# EAGLE design backpack_board (EAGLE 7.1.0)
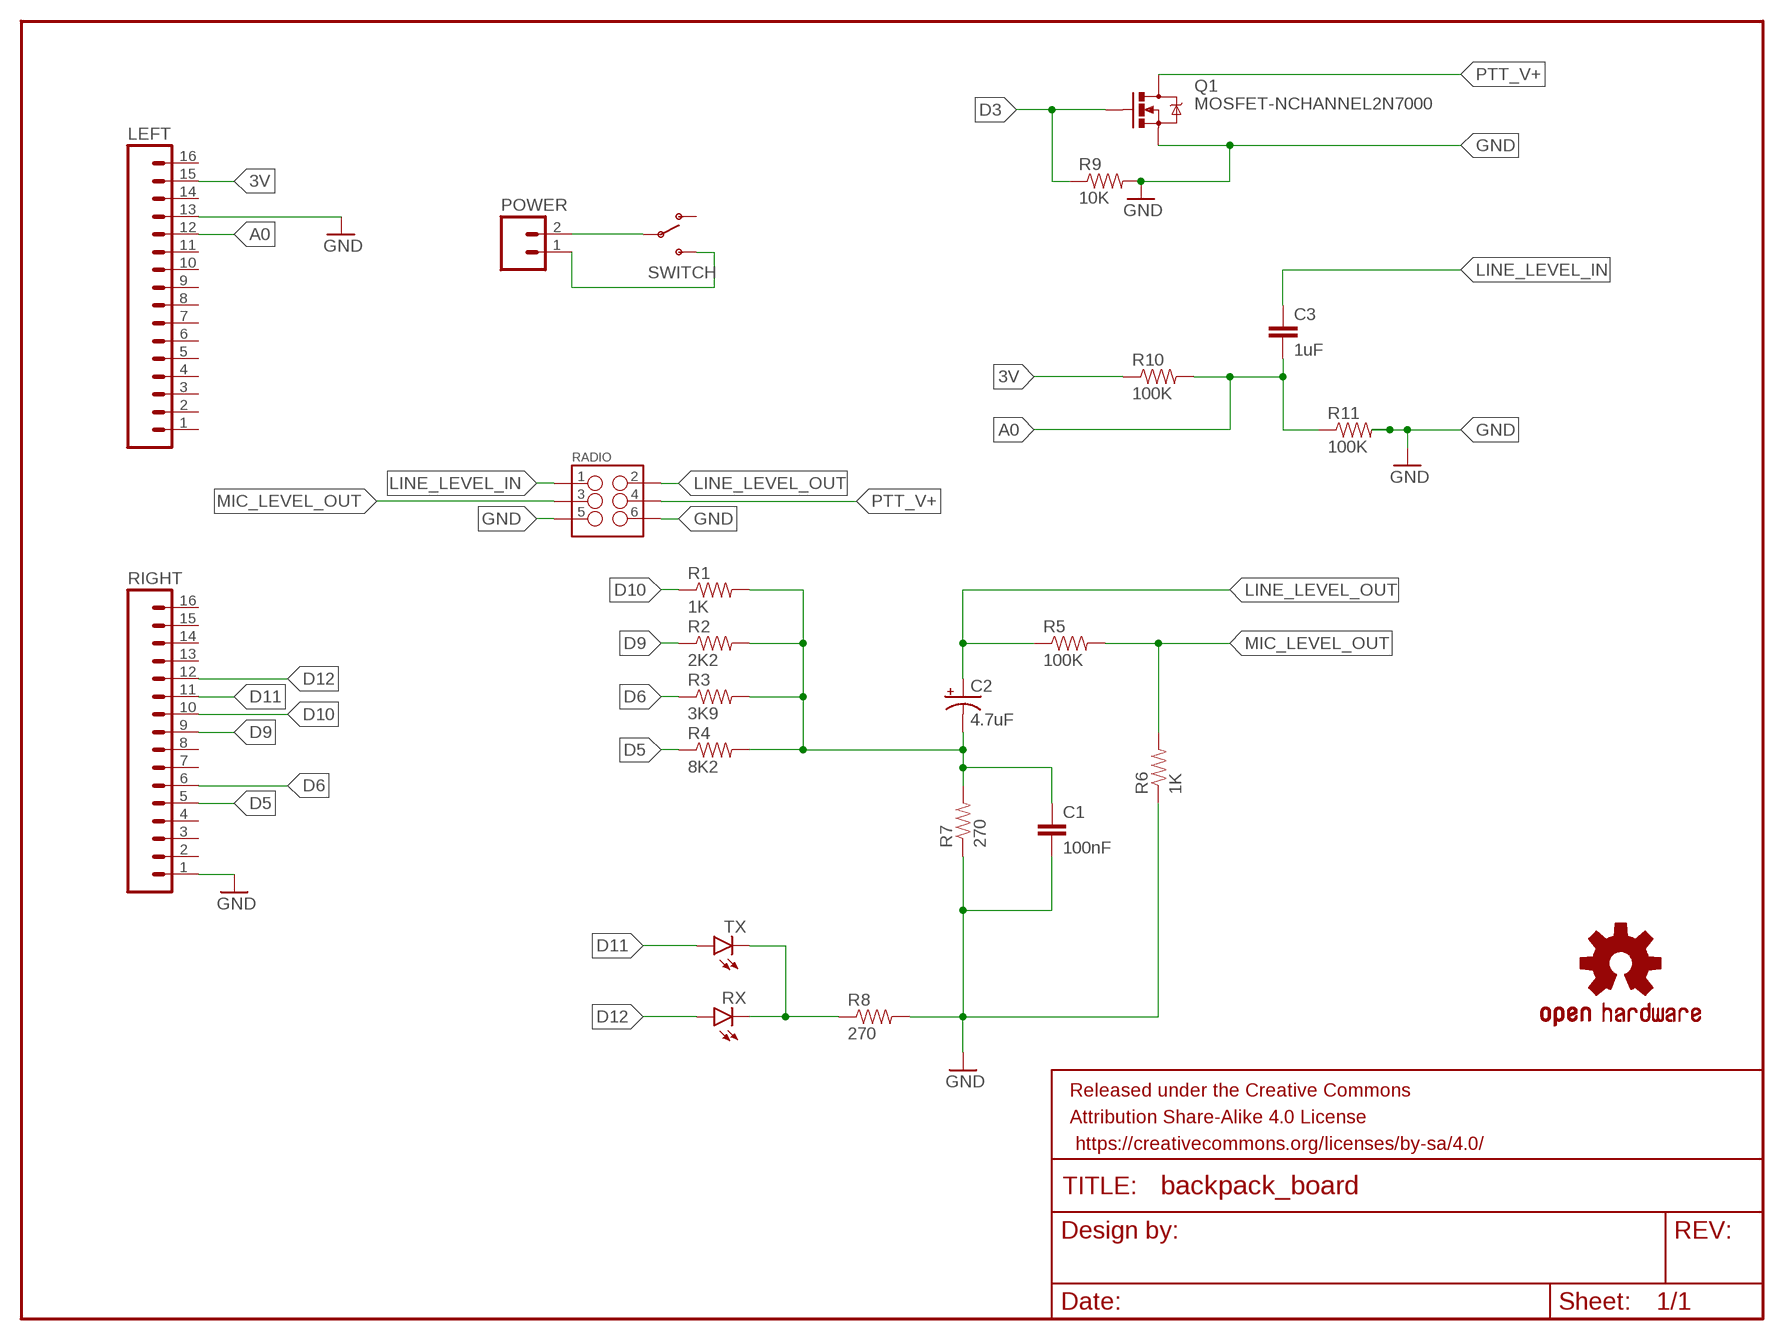
[diagram p0: schematic, sheet 1]

## Parts
C1  100nF  CAPPTH  [CAP-PTH-SMALL]
C2  4.7uF  CAP_POLPTH2  [CPOL-RADIAL-10UF-25V]
C3  1uF  CAPPTH  [CAP-PTH-SMALL]
FRAME1  FRAME-LETTERNO_PACKAGE  [DUMMY]
LEFT  M16PTH  [1X16]
LOGO1  OSHW-LOGOM  [OSHW-LOGO-M]
POWER  M02PTH  [1X02]
Q1  MOSFET-NCHANNEL2N7000  [TO-92]
R1  1K  RESISTORPTH-1/4W  [AXIAL-0.4]
R2  2K2  RESISTORPTH-1/4W  [AXIAL-0.4]
R3  3K9  RESISTORPTH-1/4W  [AXIAL-0.4]
R4  8K2  RESISTORPTH-1/4W  [AXIAL-0.4]
R5  100K  RESISTORPTH-1/4W  [AXIAL-0.4]
R6  1K  RESISTORPTH-1/4W  [AXIAL-0.4]
R7  270  RESISTORPTH-1/4W  [AXIAL-0.4]
R8  270  RESISTORPTH-1/4W  [AXIAL-0.4]
R9  10K  RESISTORPTH-1/4W  [AXIAL-0.4]
R10  100K  RESISTORPTH-1/4W  [AXIAL-0.4]
R11  100K  RESISTORPTH-1/4W  [AXIAL-0.4]
RADIO  M03X2FEMALE  [2X3]
RIGHT  M16PTH  [1X16]
RX  LED3MM  [LED3MM]
SWITCH  SWITCH-SPDTPTH  [SWITCH-SPDT]
TX  LED3MM  [LED3MM]

## Nets
3V: LEFT.15 R10.P$1
A0: C3.2 LEFT.12 R10.P$2 R11.P$1
D3: Q1.2(G) R9.P$1
D5: R4.P$1 RIGHT.5
D6: R3.P$1 RIGHT.6
D9: R2.P$1 RIGHT.9
D10: R1.P$1 RIGHT.10
D11: RIGHT.11 TX.A
D12: RIGHT.12 RX.A
GND: C1.2 LEFT.13 Q1.1(S) R6.P$1 R7.P$1 R8.P$2 R9.P$2 R11.P$2 RADIO.5 RADIO.6 RIGHT.1
LINE_LEVEL_IN: C3.1 RADIO.1
LINE_LEVEL_OUT: C2.1(+) R5.P$1 RADIO.2
MIC_LEVEL_OUT: R5.P$2 R6.P$2 RADIO.3
N$1: C1.1 C2.2(-) R1.P$2 R2.P$2 R3.P$2 R4.P$2 R7.P$2
N$2: POWER.2 SWITCH.2(P)
N$5: R8.P$1 RX.K(C) TX.K(C)
PTT_V+: Q1.3(D) RADIO.4
SWITCH: POWER.1 SWITCH.3(S)
Unconnected: LEFT.1 LEFT.2 LEFT.3 LEFT.4 LEFT.5 LEFT.6 LEFT.7 LEFT.8 LEFT.9 LEFT.10 LEFT.11 LEFT.14 LEFT.16 RIGHT.2 RIGHT.3 RIGHT.4 RIGHT.7 RIGHT.8 RIGHT.13 RIGHT.14 RIGHT.15 RIGHT.16 SWITCH.1(O)

## Library data of the parts
C1 C3 = SparkFun-Capacitors:CAP: Capacitor Standard 0603 ceramic capacitor, and 0.1" leaded capacitor.
C2 = SparkFun-Capacitors:CAP_POL: Capacitor Polarized These are standard SMD and PTH capacitors. Normally 10uF, 47uF, and 100uF in electrolytic and tantalum varieties. Always verify the external diameter of the through hole cap, it varies with capacity, voltage, and manufacturer. The EIA devices should be standard.
FRAME1 = SparkFun-Aesthetics:FRAME-LETTER: Schematic Frame Standard 8.5x11 US Letter frame; DESIGNER: Nobody; VERSION: v01
LEFT RIGHT = SparkFun-Connectors:M16: 1x16 .1" header
LOGO1 = SparkFun-Aesthetics:OSHW-LOGO: Open Source Hardware Logo This logo indicates the piece of hardware it is found on incorporates a OSHW license and/or adheres to the definition of open source hardware found here: http://freedomdefined.org/OSHW
POWER = SparkFun-Connectors:M02: Standard 2-pin 0.1" header. Use with - straight break away headers ( PRT-00116) - right angle break away headers (PRT-00553) - swiss pins (PRT-00743) - machine pins (PRT-00117) - female headers (PRT-00115) Molex polarized connector foot print use with: PRT-08233 with associated crimp pins and housings. 2.54_SCREWTERM for use with PRT-10571. 3.5mm Screw Terminal footprints for PRT-08084 5mm Screw Terminal footprints for use with PRT-08432
Q1 = SparkFun-DiscreteSemi:MOSFET-NCHANNEL: Common NMOSFET Parts MFG P/N Store ID Prod ID FDD8780 TRANS-09984 SI7820DN TRANS-11055 FDS6630A IC-08089 2N7002PW TRANS-11151 FQP30N06L COM-10213 TRANS-10060 BSS123LT1G TRANS-08345 BSS138 TRANS-00830 BS170 2N7000
R1-R11 = SparkFun-Passives:RESISTOR: Resistor Basic schematic elements and footprints for 0603, 1206, and PTH resistors.
RADIO = SparkFun-Connectors:M03X2: 2x3 .1" header. Shrouded, with keying- CONN-10681 SMT- CONN-11415 Pogo pins- HW-11044; PROD_ID: CONN-11566; VALUE: FEMALE 2x3
RX TX = SparkFun-LED:LED: LEDs Standard schematic elements and footprints for 5mm, 3mm, 1206, and 0603 sized LEDs. 5mm - Spark Fun Electronics SKU : COM-00529 (and others)
SWITCH = SparkFun-Electromechanical:SWITCH-SPDT: SPDT Switch Simple slide switch, Spark Fun Electronics SKU : COM-00102 DPDT SMT slide switch, AYZ0202, SWCH-08179; PROD_ID: SWCH-08261

## Board
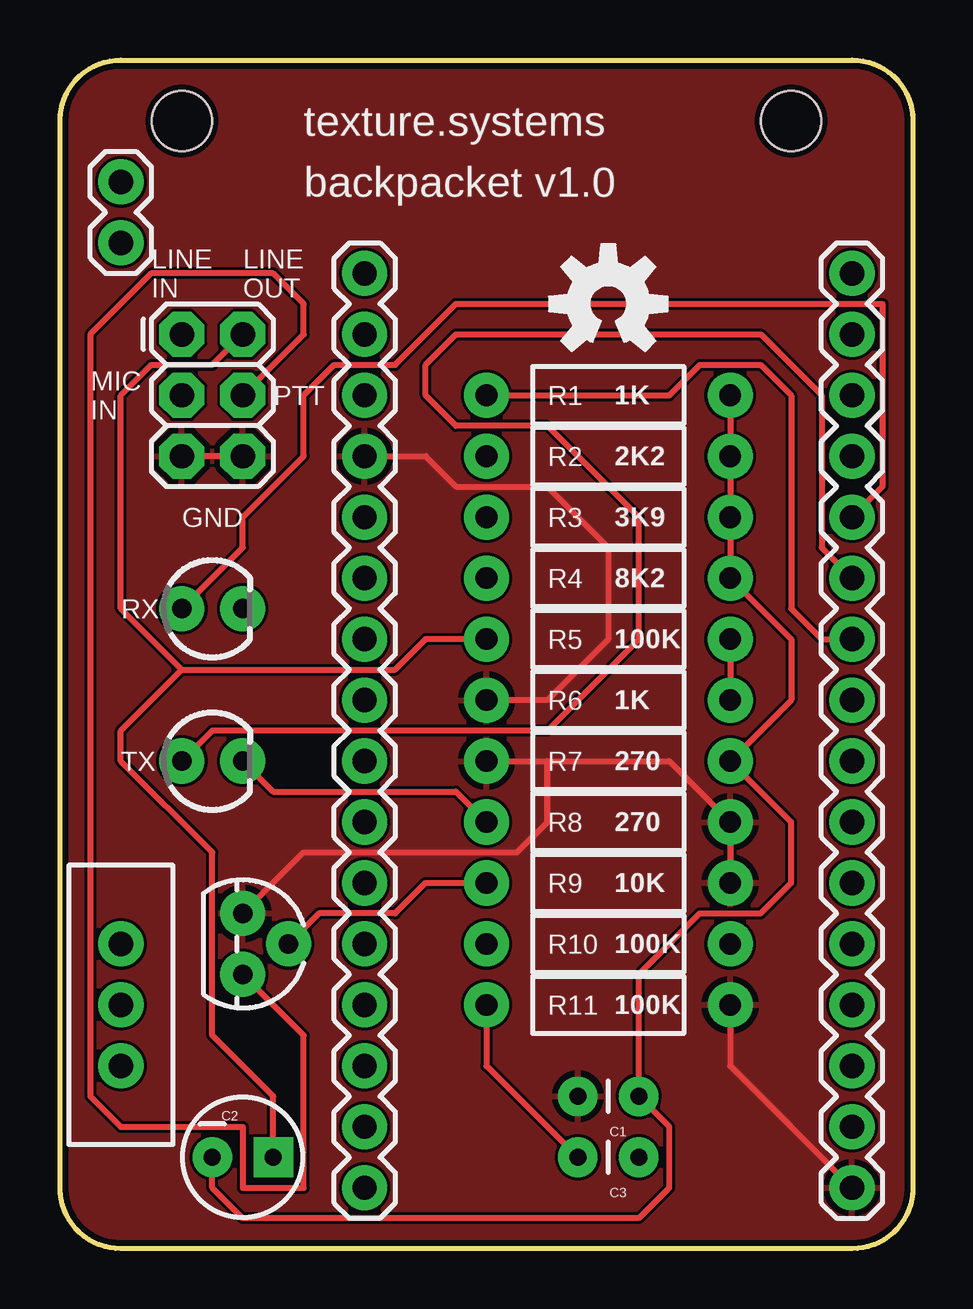
[diagram p1: board, top side]
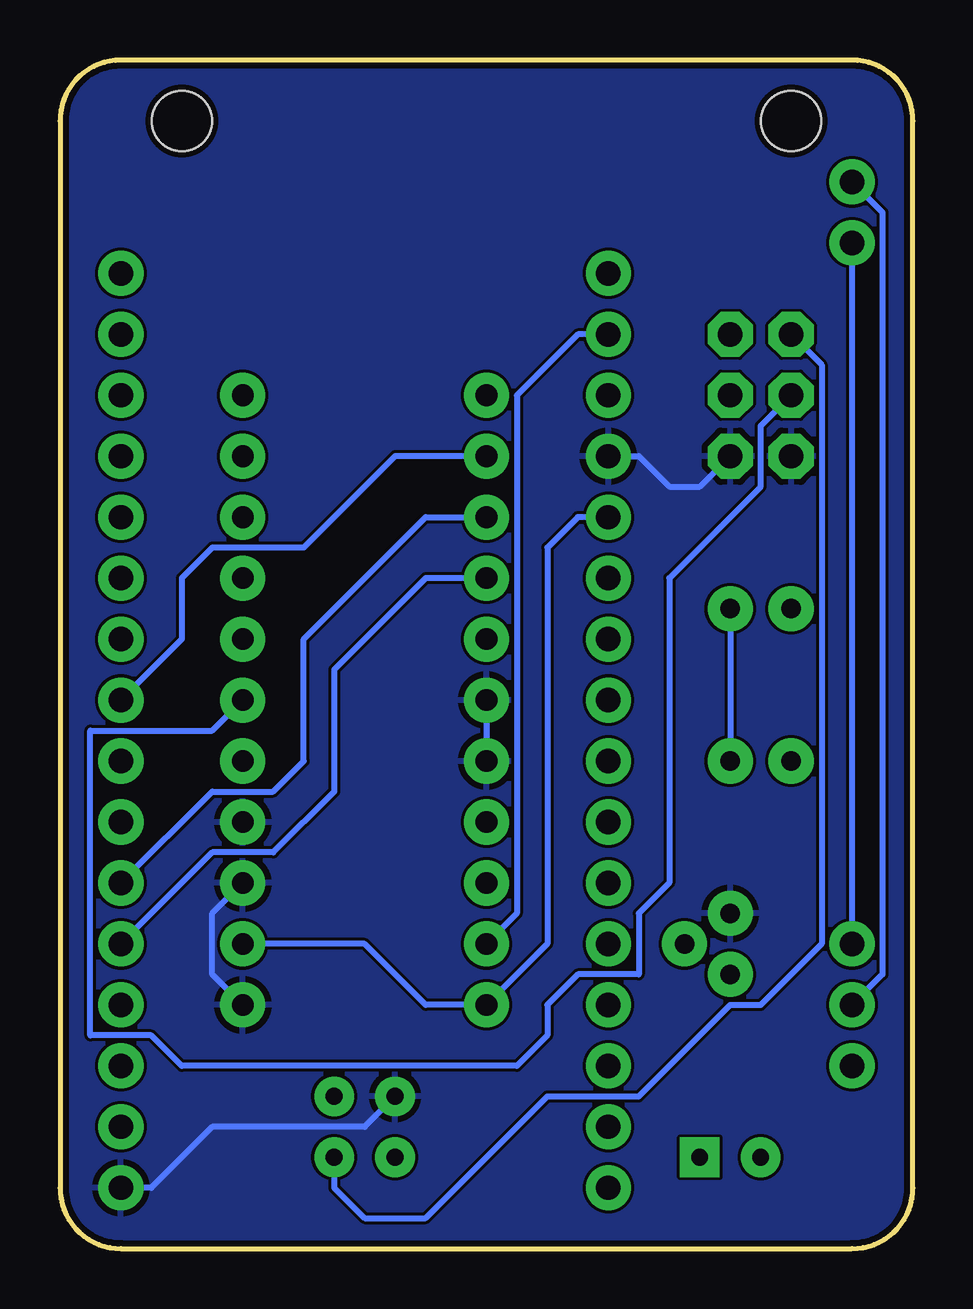
[diagram p2: board, bottom side, seen from below]

Size 35.56 x 49.53 mm. Coordinates in mm from the lower left corner, seen from the top.
Outline: 0,2.54 0,46.99 arc-90 2.54,49.53 33.02,49.53 arc-90 35.56,46.99 35.56,2.54 arc-90 33.02,0 2.54,0 arc-90 0,2.54
Copper layers (1*16): Top 0.035mm / dielectric 1.5mm / Bottom 0.035mm
Design rules "dirt_cheap_dirty_boards.v1": minimum track width 5mil, minimum drill 12mil, track to track 5mil, track to pad 5mil, pad to pad 5mil, via to via 5mil, smd to smd 0mil, copper to edge 10mil, drill to drill 10mil, minimum pad ring 10mil, minimum via ring 6mil, stop-mask expansion 2mil, vias tented up to drill 25mil, thermal gap 10mil
Holes 2.5 mm at 5.08,46.99 30.48,46.99

### Footprints (pad centres in the part's own frame; a part is rotated, then mirrored left to right if it is on the bottom)
CAP-PTH-SMALL = drill 0.7 pad 1.651: 1 0,0; 2 2.54,0
CPOL-RADIAL-10UF-25V = drill 0.7 pad 1.651 square: 1 1.27,0 | drill 0.7 pad 1.651: 2 -1.27,0
1X16 = drill 1.016 pad 1.88: 1 0,0; 2 2.54,0; 3 5.08,0; 4 7.62,0; 5 10.16,0; 6 12.7,0; 7 15.24,0; 8 17.78,0; 9 20.32,0; 10 22.86,0; 11 25.4,0; 12 27.94,0; 13 30.48,0; 14 33.02,0; 15 35.56,0; 16 38.1,0
1X02 = drill 1.016 pad 1.88: 1 0,0; 2 2.54,0
TO-92 = drill 0.813 pad 1.88: 1 -1.27,0; 2 0,1.905; 3 1.27,0
AXIAL-0.4 = drill 0.9 pad 1.88: P$1 -5.08,0; P$2 5.08,0
2X3 = drill 1.016 pad 1.88 octagon: 1 0,0; 2 0,2.54; 3 2.54,0; 4 2.54,2.54; 5 5.08,0; 6 5.08,2.54
LED3MM = drill 0.813 pad 1.88: A -1.27,0; K 1.27,0
SWITCH-SPDT = drill 1.016 pad 1.88: 1 0,2.54; 2 0,0; 3 0,-2.54

### Placement (x,y rotation side)
C1  24.13,6.35 180 top
C2  7.62,3.81 0 top
C3  24.13,3.81 180 top
FRAME1  -53.34,12.7 0 top  (outside the outline)
LEFT  12.7,2.54 90 top
LOGO1  22.86,39.37 0 top
POWER  2.54,41.91 90 top
Q1  7.62,12.7 270 top
R1  22.86,35.56 0 top
R2  22.86,33.02 0 top
R3  22.86,30.48 0 top
R4  22.86,27.94 0 top
R5  22.86,25.4 0 top
R6  22.86,22.86 0 top
R7  22.86,20.32 0 top
R8  22.86,17.78 0 top
R9  22.86,15.24 0 top
R10  22.86,12.7 0 top
R11  22.86,10.16 0 top
RADIO  5.08,38.1 270 top
RIGHT  33.02,2.54 90 top
RX  6.35,26.67 0 top
SWITCH  2.54,10.16 180 top
TX  6.35,20.32 0 top

### Tracks (layer width: path | path; a pad name or v marks a point on that pad's centre or on a via)
3V
  Bottom 0.254: LEFT.15 13.97,38.1 16.51,35.56 16.51,13.97 R10.P$1
A0
  Top 0.254: R11.P$1 17.78,7.62 C3.2
  Bottom 0.254: LEFT.12 13.97,30.48 15.24,29.21 15.24,12.7 R11.P$1 20.32,10.16 22.86,12.7 R10.P$2
D3
  Top 0.254: R9.P$1 15.24,15.24 13.97,13.97 10.79,13.97 Q1.2
D5
  Bottom 0.254: R4.P$1 20.32,27.94 24.13,24.13 24.13,19.05 26.67,16.51 29.21,16.51 RIGHT.5
D6
  Bottom 0.254: RIGHT.6 29.21,19.05 26.67,19.05 25.4,20.32 25.4,25.4 20.32,30.48 R3.P$1
D9
  Bottom 0.254: R2.P$1 21.59,33.02 25.4,29.21 29.21,29.21 30.48,27.94 30.48,25.4 RIGHT.9
D10
  Top 0.254: R1.P$1 25.4,35.56 26.67,36.83 29.21,36.83 30.48,35.56 30.48,26.67 31.75,25.4 RIGHT.10
D11
  Top 0.254: RIGHT.11 31.75,29.21 31.75,35.56 29.21,38.1 16.51,38.1 15.24,36.83 15.24,35.56 16.51,34.29 20.32,34.29 24.13,30.48 24.13,25.4 20.32,21.59 6.35,21.59 TX.A
D12
  Top 0.254: RX.A 7.62,29.21 7.62,30.48 10.16,33.02 10.16,35.56 11.43,36.83 13.97,36.83 16.51,39.37 34.29,39.37 34.29,31.75 RIGHT.12
GND
  Top 0.254: R11.P$2 27.94,7.62 RIGHT.1 | R9.P$2 R8.P$2 25.4,20.32 20.32,20.32 | R7.P$1 20.32,20.32 | LEFT.13 15.24,33.02 16.51,31.75 20.32,31.75 22.86,29.21 22.86,25.4 20.32,22.86 R6.P$1 | RADIO.6 RADIO.5 | Q1.1 10.16,16.51 19.05,16.51 20.32,17.78 20.32,20.32
  Bottom 0.254: C1.2 22.86,5.08 29.21,5.08 31.75,2.54 RIGHT.1 | R6.P$1 R7.P$1 | LEFT.13 11.43,33.02 10.16,31.75 8.89,31.75 RADIO.6 | R11.P$2 29.21,11.43 29.21,13.97 R9.P$2
  pour Bottom: 0,0 0,49.53 35.56,49.53 35.56,0
  pour Top: 0,0 0,49.53 35.56,49.53 35.56,0
LINE_LEVEL_IN
  Bottom 0.254: C3.1 24.13,2.54 22.86,1.27 20.32,1.27 15.24,6.35 11.43,6.35 7.62,10.16 6.35,10.16 3.81,12.7 3.81,36.83 RADIO.1
LINE_LEVEL_OUT
  Top 0.254: R5.P$1 15.24,25.4 13.97,24.13 5.08,24.13 | 5.08,24.13 2.54,21.59 2.54,20.32 6.35,16.51 6.35,8.89 8.89,6.35 C2.1 | 5.08,24.13 2.54,26.67 2.54,35.56 3.81,36.83 6.35,36.83 RADIO.2
MIC_LEVEL_OUT
  Top 0.254: R5.P$2 R6.P$2
  Bottom 0.254: R6.P$2 29.21,21.59 34.29,21.59 34.29,8.89 31.75,8.89 30.48,7.62 16.51,7.62 15.24,8.89 15.24,10.16 13.97,11.43 11.43,11.43 11.43,13.97 10.16,15.24 10.16,27.94 6.35,31.75 6.35,34.29 RADIO.3
N$1
  Top 0.254: R1.P$2 R2.P$2 R3.P$2 R4.P$2 30.48,25.4 30.48,22.86 R7.P$2 30.48,17.78 30.48,15.24 29.21,13.97 26.67,13.97 24.13,11.43 C1.1 25.4,5.08 25.4,2.54 24.13,1.27 7.62,1.27 6.35,2.54 C2.2
N$2
  Bottom 0.254: POWER.2 1.27,43.18 1.27,11.43 SWITCH.2
N$5
  Top 0.254: TX.K 8.89,19.05 16.51,19.05 R8.P$1
  Bottom 0.254: RX.K TX.K
PTT_V+
  Top 0.254: RADIO.4 10.16,38.1 10.16,39.37 8.89,40.64 3.81,40.64 1.27,38.1 1.27,6.35 2.54,5.08 7.62,5.08 7.62,2.54 10.16,2.54 10.16,8.89 Q1.3
SWITCH
  Bottom 0.254: POWER.1 SWITCH.3

### Text on the board
tPlace: texture.systems | backpacket v1.0 | LINE / IN | LINE / OUT | MIC / IN | PTT | R1 | R2 | GND | R3 | R4 | RX | R5 | R6 | TX | R7 | R8 | R9 | R10 | R11